# EAGLE schematic PIR_Shield (EAGLE 7.4.0)
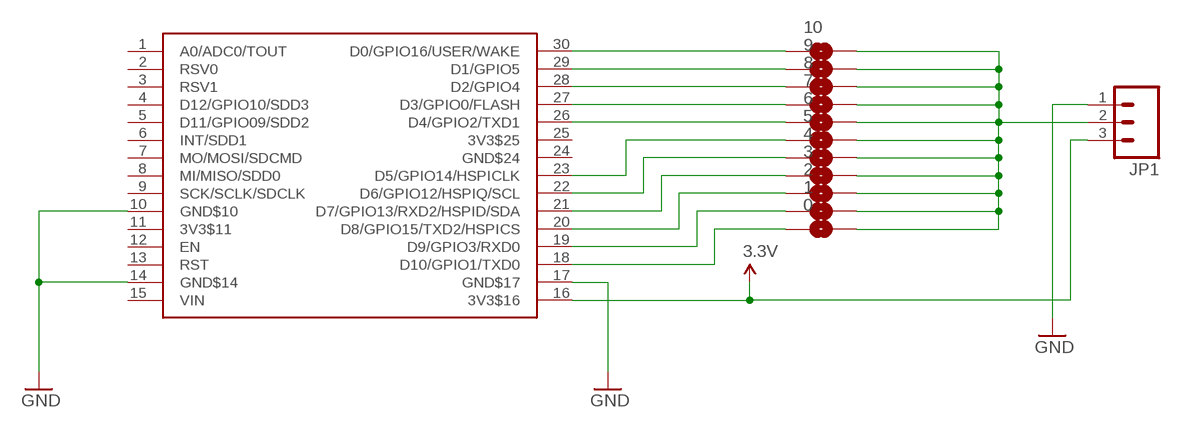
[diagram p0: schematic, sheet 1]

## Parts
0  SOLDERJUMPERNO  [SJ_2S-NO]
1  SOLDERJUMPERNO  [SJ_2S-NO]
2  SOLDERJUMPERNO  [SJ_2S-NO]
3  SOLDERJUMPERNO  [SJ_2S-NO]
4  SOLDERJUMPERNO  [SJ_2S-NO]
5  SOLDERJUMPERNO  [SJ_2S-NO]
6  SOLDERJUMPERNO  [SJ_2S-NO]
7  SOLDERJUMPERNO  [SJ_2S-NO]
8  SOLDERJUMPERNO  [SJ_2S-NO]
9  SOLDERJUMPERNO  [SJ_2S-NO]
10  SOLDERJUMPERNC  [SJ_2S]
JP1  M03PTH  [1X03]
U$1  NERDSHIELD  [NERDUINO_STACK]

## Nets
3.3V: JP1.3 U$1.16(3V3$16)
GND: JP1.1 U$1.10(GND$10) U$1.14(GND$14) U$1.17(GND$17)
N$2: 0.2 1.2 2.2 3.2 4.2 5.2 6.2 7.2 8.2 9.2 10.2 JP1.2
N$3: 10.1 U$1.30(D0/GPIO16/USER/WAKE)
N$4: 9.1 U$1.29(D1/GPIO5)
N$5: 8.1 U$1.28(D2/GPIO4)
N$6: 7.1 U$1.27(D3/GPIO0/FLASH)
N$7: 6.1 U$1.26(D4/GPIO2/TXD1)
N$8: 5.1 U$1.23(D5/GPIO14/HSPICLK)
N$9: 4.1 U$1.22(D6/GPIO12/HSPIQ/SCL)
N$10: 3.1 U$1.21(D7/GPIO13/RXD2/HSPID/SDA)
N$11: 2.1 U$1.20(D8/GPIO15/TXD2/HSPICS)
N$12: 1.1 U$1.19(D9/GPIO3/RXD0)
N$13: 0.1 U$1.18(D10/GPIO1/TXD0)
Unconnected: U$1.1(A0/ADC0/TOUT) U$1.2(RSV0) U$1.3(RSV1) U$1.4(D12/GPIO10/SDD3) U$1.5(D11/GPIO09/SDD2) U$1.6(INT/SDD1) U$1.7(MO/MOSI/SDCMD) U$1.8(MI/MISO/SDD0) U$1.9(SCK/SCLK/SDCLK) U$1.11(3V3$11) U$1.12(EN) U$1.13(RST) U$1.15(VIN) U$1.24(GND$24) U$1.25(3V3$25)

## Library data of the parts
0 1-10 = SparkFun:SOLDERJUMPER: Solder Jumper Standard SMD solder jumper. Used to automate production. Two varients : Normally Open and Normally Closed are the same, but have different paste layers. NC will have a large amount of paste and should jumper during reflow.
JP1 = SparkFun:M03: Header 3 Standard 3-pin 0.1" header. Use with straight break away headers (SKU : PRT-00116), right angle break away headers (PRT-00553), swiss pins (PRT-00743), machine pins (PRT-00117), and female headers (PRT-00115). Molex polarized connector foot print use with SKU : PRT-08232 with associated crimp pins and housings.
U$1 = NerduinoShieldLib:NERDSHIELD